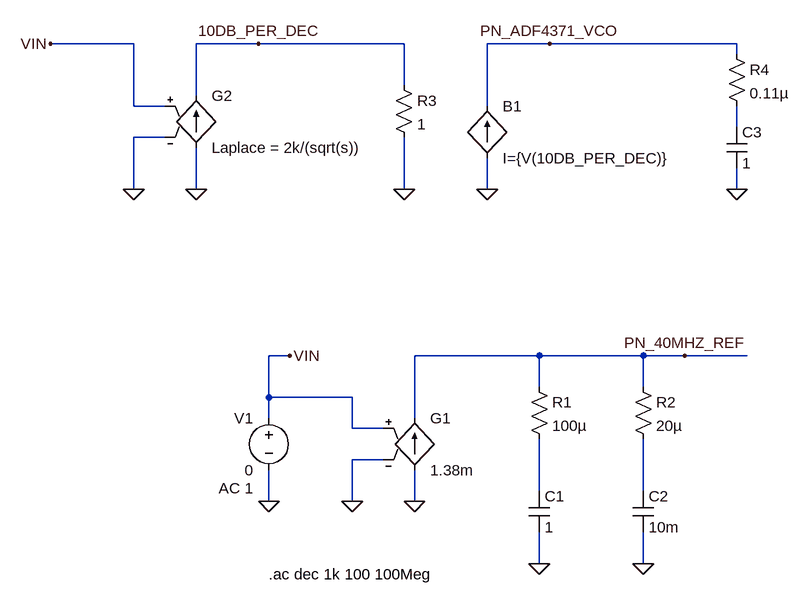
[diagram p0: schematic Example_Ref_TCXO_Phase_Noise_Model.asc]
Example_Ref_TCXO_Phase_Noise_Model.asc, the LTspice schematic file:
Version 4
SHEET 1 1288 680
WIRE -304 -464 -432 -464
WIRE -112 -464 -208 -464
WIRE 112 -464 -112 -464
WIRE 336 -464 240 -464
WIRE 624 -464 336 -464
WIRE 624 -448 624 -464
WIRE 112 -400 112 -464
WIRE -208 -384 -208 -464
WIRE -304 -368 -304 -464
WIRE -256 -368 -304 -368
WIRE 240 -368 240 -464
WIRE 624 -336 624 -368
WIRE -256 -320 -304 -320
WIRE -304 -240 -304 -320
WIRE -208 -240 -208 -304
WIRE 112 -240 112 -320
WIRE 240 -240 240 -288
WIRE 624 -240 624 -272
WIRE -64 16 -96 16
WIRE 320 16 128 16
WIRE 480 16 320 16
WIRE 544 16 480 16
WIRE 640 16 544 16
WIRE 320 64 320 16
WIRE 480 64 480 16
WIRE -96 80 -96 16
WIRE 32 80 -96 80
WIRE -96 112 -96 80
WIRE 128 112 128 16
WIRE 32 128 32 80
WIRE 80 128 32 128
WIRE 80 176 32 176
WIRE 320 224 320 144
WIRE 480 224 480 144
WIRE -96 240 -96 192
WIRE 32 240 32 176
WIRE 128 240 128 192
WIRE 320 336 320 288
WIRE 480 336 480 288
FLAG 128 240 0
FLAG 32 240 0
FLAG -96 240 0
FLAG 320 336 0
FLAG 480 336 0
FLAG -64 16 VIN
FLAG -208 -240 0
FLAG -304 -240 0
FLAG 112 -240 0
FLAG -432 -464 VIN
FLAG -112 -464 10DB_PER_DEC
FLAG 240 -240 0
FLAG 624 -240 0
FLAG 336 -464 PN_ADF4371_VCO
FLAG 544 16 PN_40MHZ_REF
SYMBOL g 128 96 R0
SYMATTR InstName G1
SYMATTR Value 1.38m
SYMBOL voltage -96 96 M0
WINDOW 123 24 124 Left 2
WINDOW 39 0 0 Left 0
SYMATTR Value2 AC 1
SYMATTR InstName V1
SYMATTR Value 0
SYMBOL cap 304 224 R0
SYMATTR InstName C1
SYMATTR Value 1
SYMBOL res 304 48 R0
SYMATTR InstName R1
SYMATTR Value 100µ
SYMBOL cap 464 224 R0
SYMATTR InstName C2
SYMATTR Value 10m
SYMBOL res 464 48 R0
SYMATTR InstName R2
SYMATTR Value 20µ
SYMBOL g -208 -400 R0
SYMATTR InstName G2
SYMATTR Value Laplace = 2k/(sqrt(s))
SYMBOL res 96 -416 R0
SYMATTR InstName R3
SYMATTR Value 1
SYMBOL bi 240 -288 M180
WINDOW 0 24 80 Left 2
WINDOW 3 24 0 Left 2
SYMATTR InstName B1
SYMATTR Value I={V(10DB_PER_DEC)}
SYMBOL cap 608 -336 R0
SYMATTR InstName C3
SYMATTR Value 1
SYMBOL res 608 -464 R0
SYMATTR InstName R4
SYMATTR Value 0.11µ
TEXT -96 352 Left 2 !.ac dec 1k 100 100Meg

The netlist it stands for:
* Example_Ref_TCXO_Phase_Noise_Model.asc
G1 0 PN_40MHZ_REF VIN 0 1.38m
V1 VIN 0 0 AC 1
C1 N002 0 1
R1 PN_40MHZ_REF N002 100µ
C2 N003 0 10m
R2 PN_40MHZ_REF N003 20µ
G2 0 10DB_PER_DEC VIN 0 Laplace = 2k/(sqrt(s))
R3 10DB_PER_DEC 0 1
B1 0 PN_ADF4371_VCO I={V(10DB_PER_DEC)}
C3 N001 0 1
R4 PN_ADF4371_VCO N001 0.11µ
.ac dec 1k 100 100Meg
.backanno
.end

* Results of the author's LTspice run, read from the files saved beside the schematic
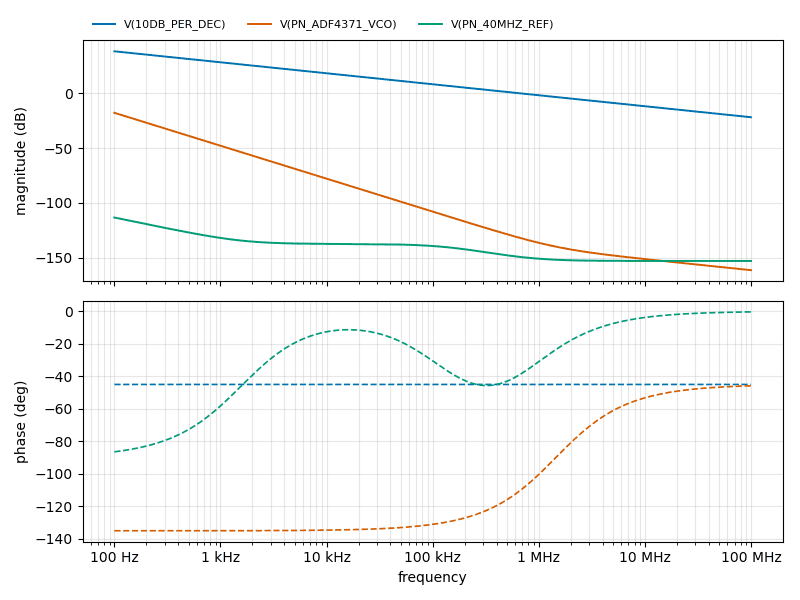
[diagram p1: AC Analysis of Example_Ref_TCXO_Phase_Noise_Model.asc, plotted from the saved traces]
* AC Analysis, 1 run:
*   V(10DB_PER_DEC): 38.04 dB at 100 Hz, -21.96 dB at 100 MHz, peak 38.04 dB at 100 Hz, 3 dB below the peak at 200 Hz
*   V(PN_ADF4371_VCO): -17.92 dB at 100 Hz, -161.13 dB at 100 MHz, peak -17.92 dB at 100 Hz, 3 dB below the peak at 126 Hz
*   V(PN_40MHZ_REF): -113.24 dB at 100 Hz, -152.77 dB at 100 MHz, peak -113.24 dB at 100 Hz, 3 dB below the peak at 141.7 Hz